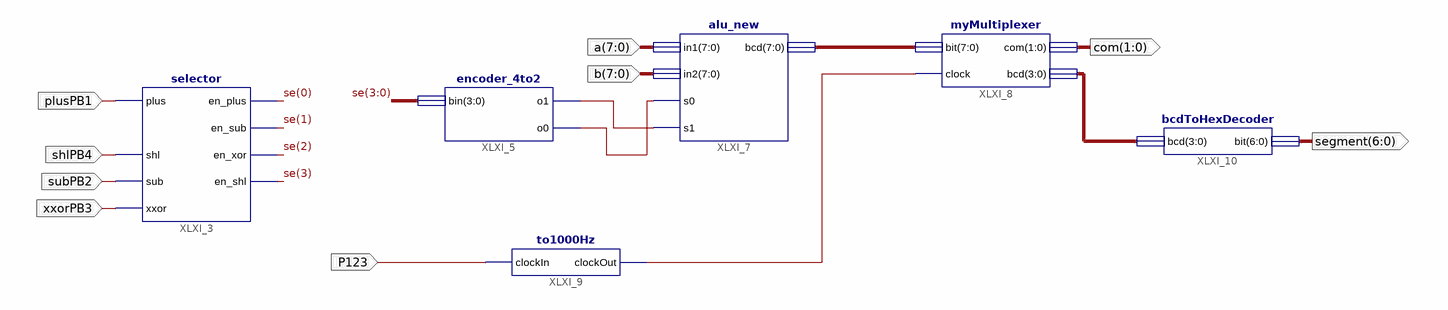
[diagram p0: schematic sheet 1]
// Xilinx ISE schematic lab9.sch (spartan6) as structural Verilog: 6 symbols, 9 ports
module lab9 (
  input  [7:0] a,
  input  [7:0] b,
  input  P123,
  input  plusPB1,
  input  shlPB4,
  input  subPB2,
  input  xxorPB3,
  output [1:0] com,
  output [6:0] segment
);

  wire XLXN_20, XLXN_21, XLXN_31;
  wire [3:0] se, XLXN_33;
  wire [7:0] XLXN_32;

  selector XLXI_3 (
    .plus(plusPB1), .shl(shlPB4), .sub(subPB2), .xxor(xxorPB3), .en_plus(se[0]), .en_sub(se[1]),
    .en_xor(se[2]), .en_shl(se[3]));
  encoder_4to2 XLXI_5 (.bin(se), .o1(XLXN_20), .o0(XLXN_21));
  alu_new XLXI_7 (.in1(a), .in2(b), .s0(XLXN_21), .s1(XLXN_20), .bcd(XLXN_32));
  myMultiplexer XLXI_8 (.\bit (XLXN_32), .clock(XLXN_31), .com(com), .bcd(XLXN_33));
  to1000Hz XLXI_9 (.clockIn(P123), .clockOut(XLXN_31));
  bcdToHexDecoder XLXI_10 (.bcd(XLXN_33), .\bit (segment));

  // Notes on the sheet:
  //   CLOCK_DEDICATED_ROUTE on signal plusPB1 = TRUE
  //   CLOCK_DEDICATED_ROUTE on signal shlPB4 = TRUE
  //   CLOCK_DEDICATED_ROUTE on signal subPB2 = TRUE
  //   CLOCK_DEDICATED_ROUTE on signal xxorPB3 = TRUE
endmodule
